# Altium schematic sheet FET Microcontroller.SchDoc
size 406 x 304 mm; SheetNumber: 4; SheetTotal: 4
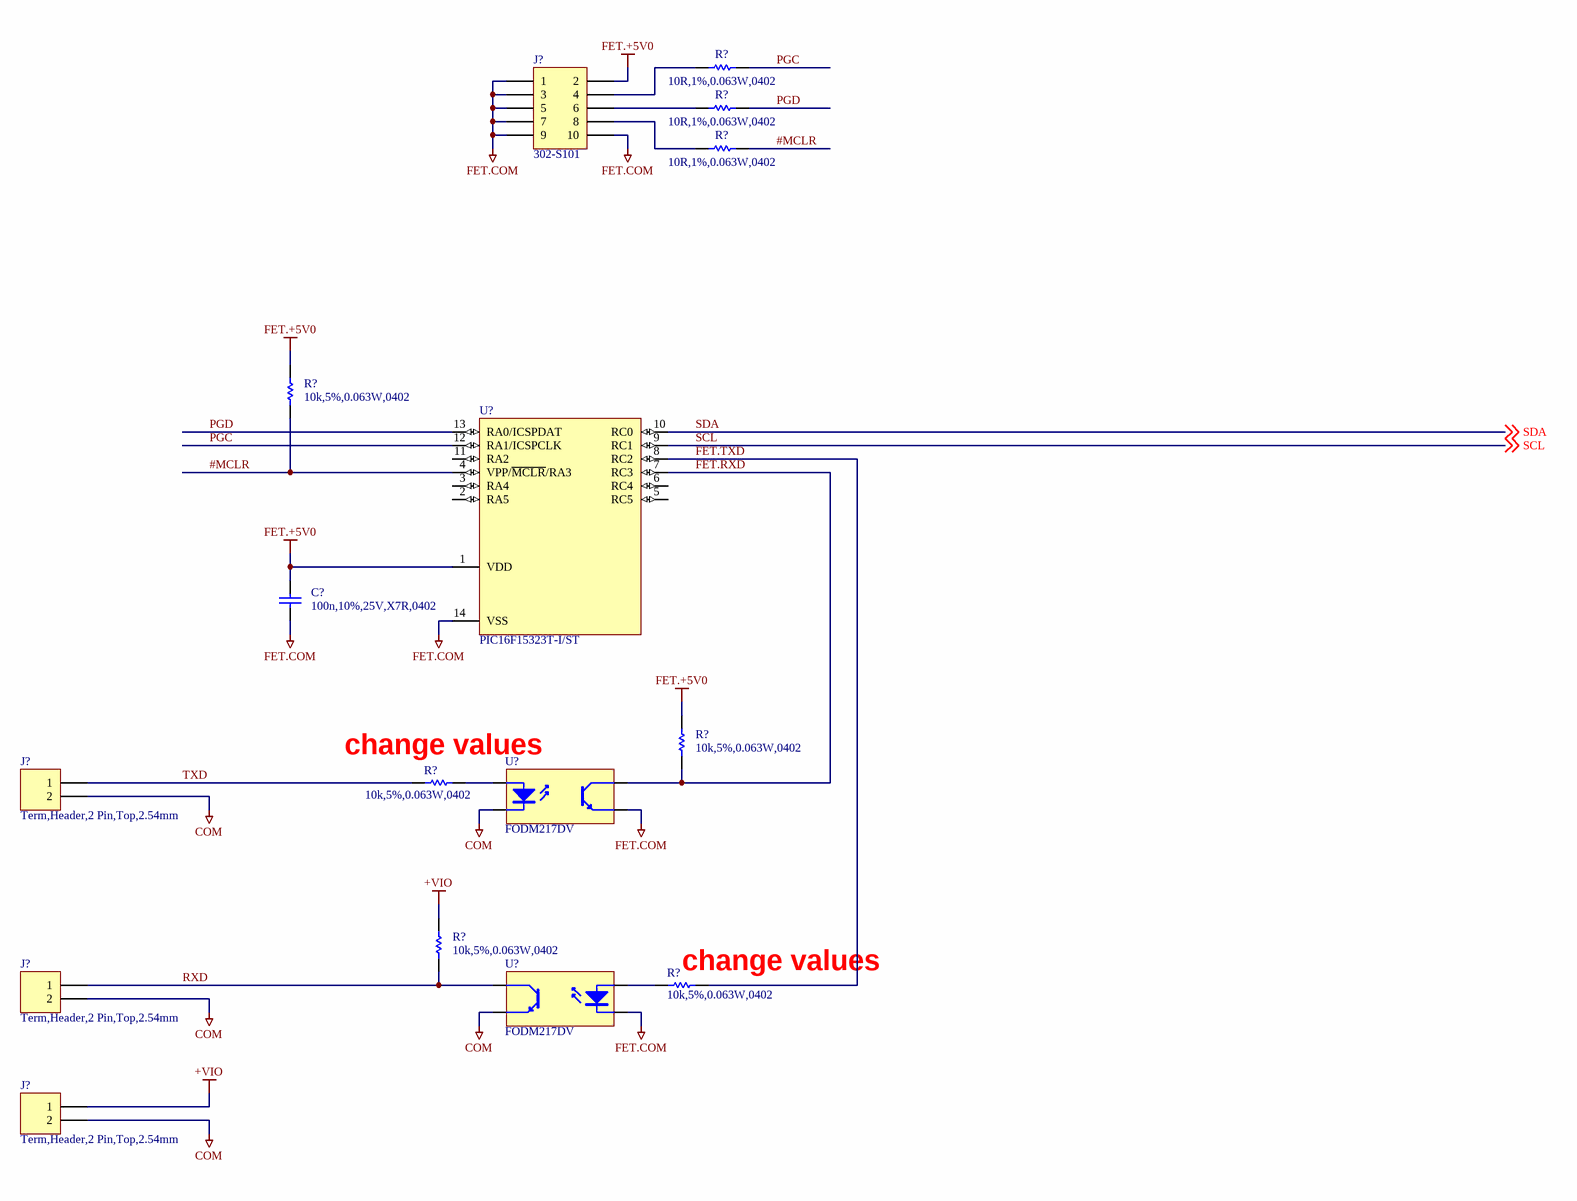
[diagram p0: FET Microcontroller.SchDoc]

## Parts
(Parts that share a designator on the sheet are numbered #1, #2 ... from top to bottom, then left to right.)
C?  100n,10%,25V,X7R,0402  [CAPC1005X06N]
J?#1  302-S101  [ONSHORE_302-S101]
J?#2  Term,Header,2 Pin,Top,2.54mm  [WURTH_61300211121]
J?#3  Term,Header,2 Pin,Top,2.54mm  [WURTH_61300211121]
J?#4  Term,Header,2 Pin,Top,2.54mm  [WURTH_61300211121]
R?#1  10R,1%,0.063W,0402  [RESC1005X04N]
R?#2  10R,1%,0.063W,0402  [RESC1005X04N]
R?#3  10R,1%,0.063W,0402  [RESC1005X04N]
R?#4  10k,5%,0.063W,0402  [RESC1005X04N]
R?#5  10k,5%,0.063W,0402  [RESC1005X04N]
R?#6  10k,5%,0.063W,0402  [RESC1005X04N]
R?#7  10k,5%,0.063W,0402  [RESC1005X04N]
R?#8  10k,5%,0.063W,0402  [RESC1005X04N]
U?#1  PIC16F15323T-I/ST  [MICROCHIP_PKG_TSSOP-14(C04-2087A)]
U?#2  FODM217DV  [ONSEMI_MFP4-2.5X4.4]
U?#3  FODM217DV  [ONSEMI_MFP4-2.5X4.4]

## Nets
+VIO: J?#4.1 R?#7.2
COM: J?#2.2 J?#3.2 J?#4.2 U?#2.2(K) U?#3.3(E)
FET.+5V0: C?.2 J?#1.2 R?#4.2 R?#5.2 U?#1.1(VDD)
FET.COM: C?.1 J?#1.1 J?#1.3 J?#1.5 J?#1.7 J?#1.9 J?#1.10 U?#1.14(VSS) U?#2.3(E) U?#3.2(K)
#MCLR: R?#3.2 R?#4.1 U?#1.4(VPP/~{MCLR}/RA3)
FET.RXD: R?#5.1 U?#1.7(RC3) U?#2.4(C)
FET.TXD: R?#8.1 U?#1.8(RC2)
PGC: R?#1.2 U?#1.12(RA1/ICSPCLK)
PGD: R?#2.2 U?#1.13(RA0/ICSPDAT)
RXD: J?#3.1 R?#7.1 U?#3.4(C)
SCL: U?#1.9(RC1) ; off-sheet SCL
SDA: U?#1.10(RC0) ; off-sheet SDA
TXD: J?#2.1 R?#6.2
NetJ?#1_4: J?#1.4 R?#1.1
NetJ?#1_6: J?#1.6 R?#2.1
NetJ?#1_8: J?#1.8 R?#3.1
NetR?#6_1: R?#6.1 U?#2.1(A)
NetR?#8_2: R?#8.2 U?#3.1(A)

Not connected (* = marked no-connect by the designer): U?#1 2(RA5) 3(RA4) 5(RC5) 6(RC4) 11(RA2)

## Notes on the sheet
- change values
- (near R?#8) change values
- Rev
- Sheet Name:
- Date:
- Sheet
- Designer:
- of

## Library data of the parts
C? = CAP,Cer,100nF,10%,25V,X7R,0402: 0.1ï¿½F ï¿½10% 25V Ceramic Capacitor X7R 0402 (1005 Metric); Manufacturer 1: Murata Electronics; Manufacturer 1 Part Number: GRM155R71E104KE14J; Vendor 1 Part Number: 490-14603-1-ND; Vendor 1: DigiKey; Value: 100nF; Part Name: CAP,Cer,100nF,10%,25V,X7R,0402; CreatedBy: Judd Foster; HelpURL: https://search.murata.co.jp/Ceramy/image/img/A01X/G101/ENG/GRM155R71E104KE14-01.pdf
J?#1 = Term,Header,5x2 Pin,2.54mm,Thru: Connector Header Through Hole 10 position 0.100" (2.54mm); Manufacturer 1: On Shore Technology Inc.; Vendor 1 Part Number: ED1543-ND; Vendor 1: Digikey; Part Name: Term,Header,5x2 Pin,2.54mm,Thru; CreatedBy: Judd Foster; HelpURL: https://mm.digikey.com/Volume0/opasdata/d220001/medias/docus/6025/302-S.pdf; Manufacturer 1 Part Number: 302-S101
J?#2-J?#4 = Term,Header,2 Pin,Top,2.54mm: Connector Header Through Hole 2 position 0.100" (2.54mm); Manufacturer 1: WÃ¼rth Elektronik; Manufacturer 1 Part Number: 61300211121; Vendor 1 Part Number: 732-5315-ND; Vendor 1: DigiKey; Part Name: Term,Header,2 Pin,Top,2.54mm; CreatedBy: Judd Foster; HelpURL: https://www.we-online.com/components/products/datasheet/61300211121.pdf
R?#1-R?#3 = RES,10R,1%,0.063W,0402: 10 Ohms ï¿½1% 0.063W, 1/16W Chip Resistor 0402 (1005 Metric) Automotive AEC-Q200 Thick Film; Manufacturer 1: Panasonic Electronic Components; Manufacturer 1 Part Number: ERJ-2RKF10R0X; Vendor 1 Part Number: P10.0LCT-ND; Vendor 1: Digikey; Part Name: RES,10R,1%,0.063W,0402; CreatedBy: Judd Foster; HelpURL: https://industrial.panasonic.com/cdbs/www-data/pdf/RDA0000/AOA0000C304.pdf; Value: 10R
R?#4-R?#8 = RES,10k,5%,0.063W,0402: 10 kOhms ï¿½5% 0.063W, 1/16W Chip Resistor 0402 (1005 Metric) Automotive AEC-Q200 Thick Film; Manufacturer 1: Stackpole Electronics Inc; Manufacturer 1 Part Number: RMCF0402JT10K0; Vendor 1 Part Number: RMCF0402JT10K0CT-ND; Vendor 1: DIgikey; Part Name: RES,10k,5%,0.063W,0402; CreatedBy: Judd Foster; HelpURL: https://www.seielect.com/catalog/sei-rmcf_rmcp.pdf; Value: 10k
U?#1 = PIC16F15323T-I_ST: PIC PICÂ® XLPâ„¢ 16F Microcontroller IC 8-Bit 32MHz 3.5KB (2K x 14) FLASH 14-TSSOP; Manufacturer 1: Microchip Technology; Vendor 1 Part Number: PIC16F15323T-I/STCT-ND; Vendor 1: DigiKey; Part Name: PIC16F15323T-I_ST; CreatedBy: Judd Foster; HelpURL: https://ww1.microchip.com/downloads/en/DeviceDoc/PIC16_L_F15313_23_Data_Sheet_40001897C.pdf; Manufacturer 1 Part Number: PIC16F15323T-I/ST
U?#2 U?#3 = OPTO,Phototrans,3750Vrms,SMD: Optoisolator Transistor Output 3750Vrms Channel 4-SOP; Manufacturer 1: onsemi; Vendor 1 Part Number: FODM217DVOS-ND; Vendor 1: Digikey; Part Name: OPTO,Phototrans,3750Vrms,SMD; CreatedBy: Judd Foster; HelpURL: https://www.onsemi.com/pdf/datasheet/fodm214-d.pdf; Manufacturer 1 Part Number: FODM217DV